# EAGLE design element-pro (EAGLE 9.1.1)
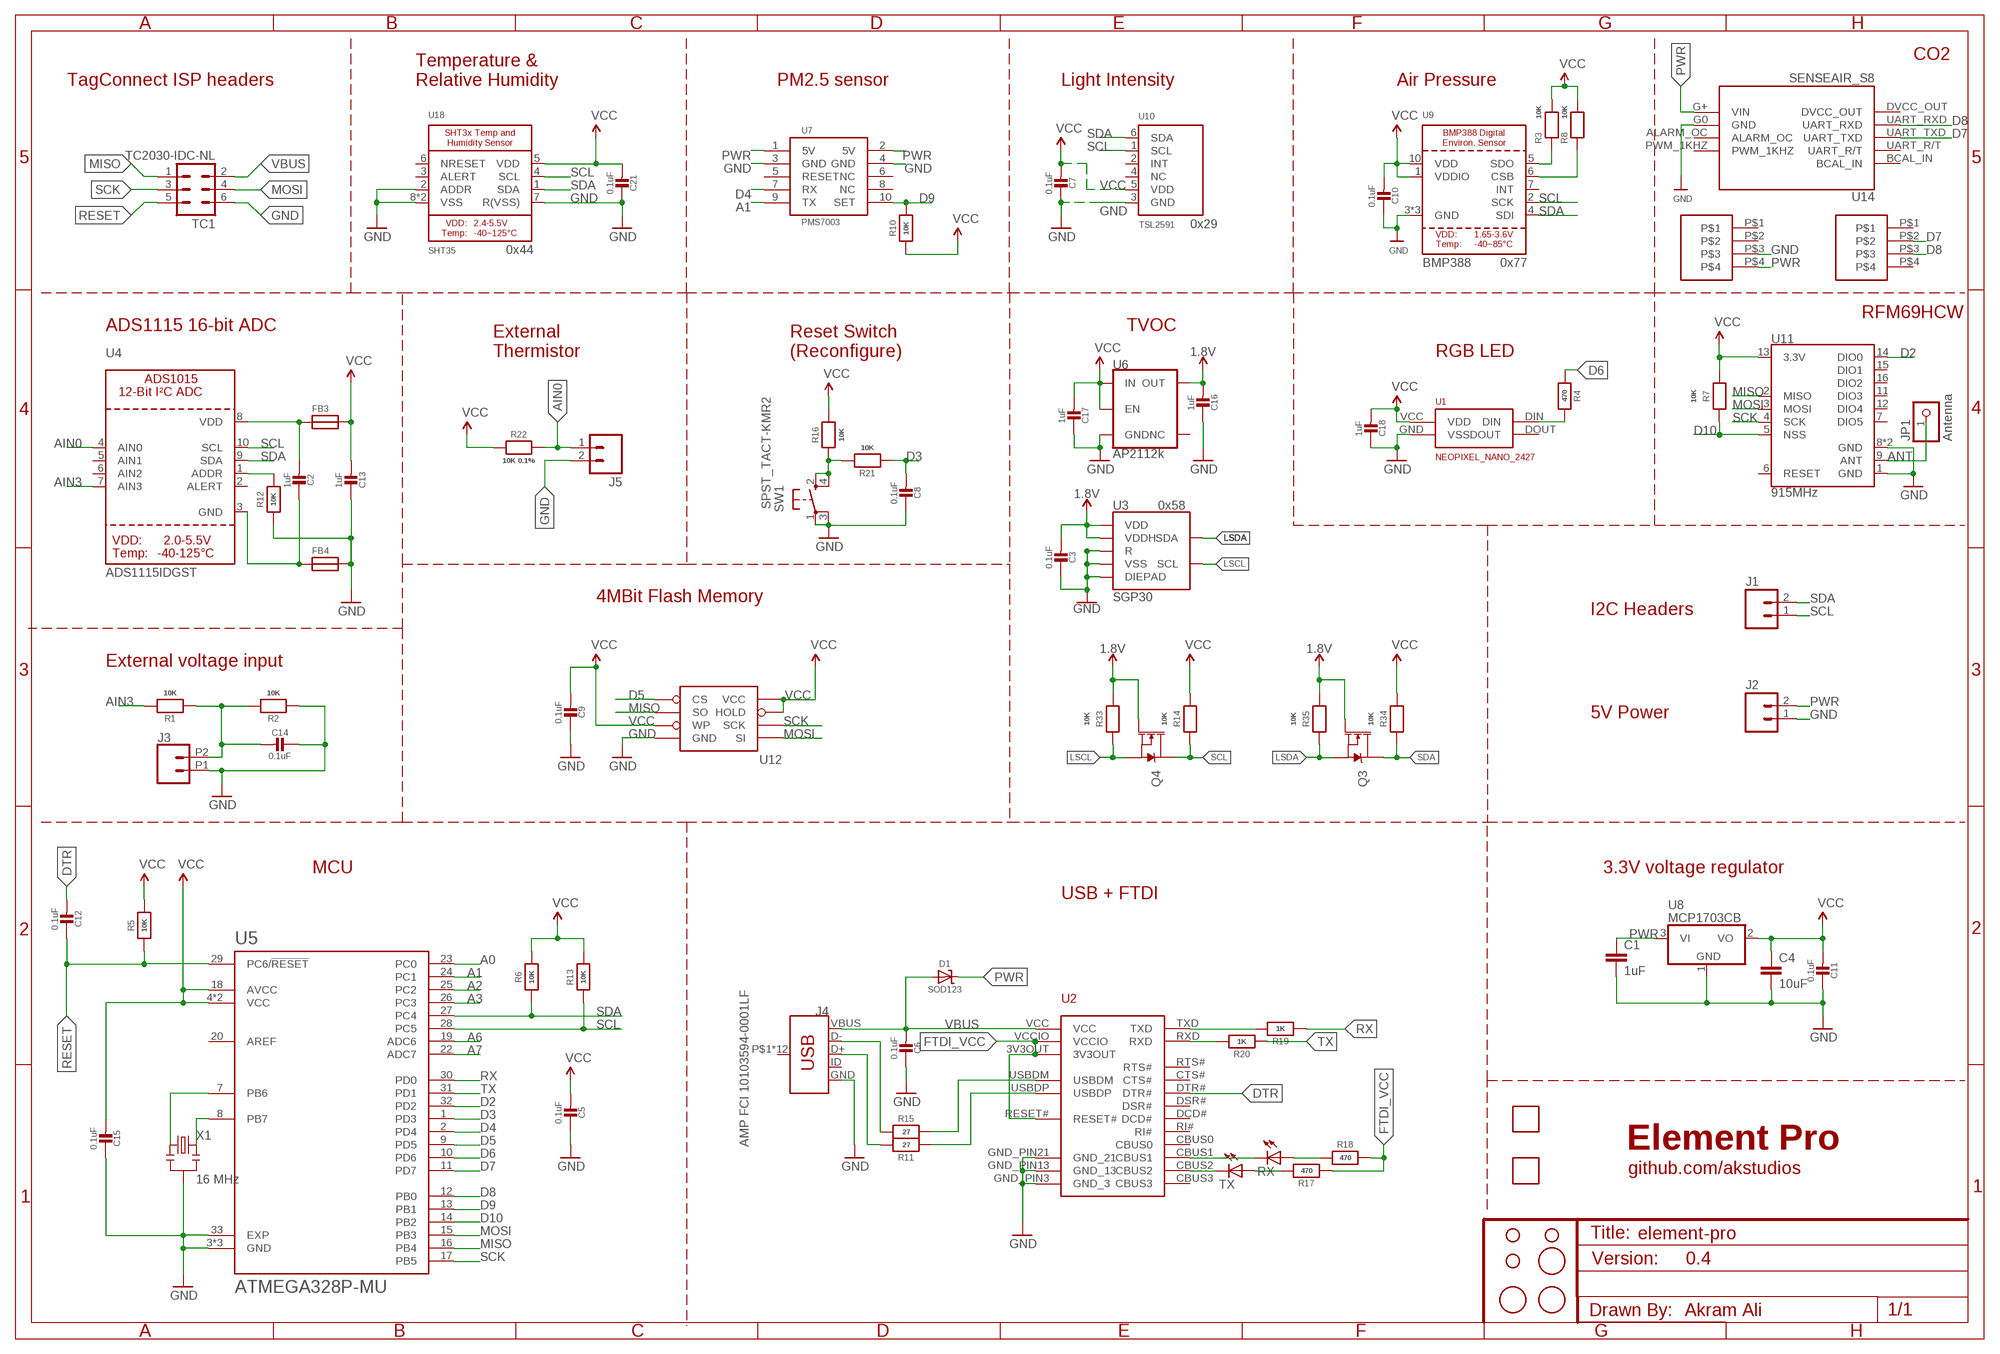
[diagram p0: schematic, sheet 1]

## Parts
C1  1uF  CAP0805  [0805@1]
C2  1uF  MICROBUILDER_CAP_CERAMIC_0402MP  [MICROBUILDER__0402MP]
C3  0.1uF  MICROBUILDER_CAP_CERAMIC_0402MP  [MICROBUILDER__0402MP]
C4  10uF  CAP0805  [0805@1]
C5  0.1uF  MICROBUILDER_CAP_CERAMIC_0402MP  [MICROBUILDER__0402MP]
C6  0.1uF  MICROBUILDER_CAP_CERAMIC_0402MP  [MICROBUILDER__0402MP]
C7  0.1uF  MICROBUILDER_CAP_CERAMIC_0402MP  [MICROBUILDER__0402MP]
C8  0.1uF  MICROBUILDER_CAP_CERAMIC_0402MP  [MICROBUILDER__0402MP]
C9  0.1uF  MICROBUILDER_CAP_CERAMIC_0402MP  [MICROBUILDER__0402MP]
C10  0.1uF  MICROBUILDER_CAP_CERAMIC_0402MP  [MICROBUILDER__0402MP]
C11  0.1uF  MICROBUILDER_CAP_CERAMIC_0402MP  [MICROBUILDER__0402MP]
C12  0.1uF  MICROBUILDER_CAP_CERAMIC_0402MP  [MICROBUILDER__0402MP]
C13  1uF  MICROBUILDER_CAP_CERAMIC_0402MP  [MICROBUILDER__0402MP]
C14  0.1uF  MICROBUILDER_CAP_CERAMIC_0402MP  [MICROBUILDER__0402MP]
C15  0.1uF  MICROBUILDER_CAP_CERAMIC_0402MP  [MICROBUILDER__0402MP]
C16  1uF  MICROBUILDER_CAP_CERAMIC_0402MP  [MICROBUILDER__0402MP]
C17  1uF  MICROBUILDER_CAP_CERAMIC_0402MP  [MICROBUILDER__0402MP]
C18  1uF  MICROBUILDER_CAP_CERAMIC_0402MP  [MICROBUILDER__0402MP]
C21  0.1uF  MICROBUILDER_CAP_CERAMIC_0402MP  [MICROBUILDER__0402MP]
D1  SOD123  MICROBUILDER_DIODE-SCHOTTKYSOD-123  [MICROBUILDER_SOD-123]
FB3  FERRITE0402  [0402]
FB4  FERRITE0402  [0402]
H1  STAND-OFF  [STAND-OFF]
H2  STAND-OFF  [STAND-OFF]
H3  STAND-OFF  [STAND-OFF]
J1  M02PTH  [1X02@1]
J2  M02PTH  [1X02@1]
J3  CONN_022.54MM_SCREWTERM  [1X02_2.54_SCREWTERM]
J4  AMP FCI 10103594-0001LF  USB_MICRO-B_HALF_PTH  [USB-MICROB-PTH]
J5  M02PTH  [1X02@1]
JP1  Antenna  PINHD-1X1CB  [1X01-CLEANBIG]
Q3  BSS138PW,115  MOSFET-NCH-BSS138PW,115  [SOT323]
Q4  BSS138PW,115  MOSFET-NCH-BSS138PW,115  [SOT323]
R1  10K  MICROBUILDER_RESISTOR_0402MP  [MICROBUILDER__0402MP]
R2  10K  MICROBUILDER_RESISTOR_0402MP  [MICROBUILDER__0402MP]
R3  10K  MICROBUILDER_RESISTOR_0402MP  [MICROBUILDER__0402MP]
R4  470  MICROBUILDER_RESISTOR_0402MP  [MICROBUILDER__0402MP]
R5  10K  MICROBUILDER_RESISTOR_0402MP  [MICROBUILDER__0402MP]
R6  10K  MICROBUILDER_RESISTOR_0402MP  [MICROBUILDER__0402MP]
R7  10K  MICROBUILDER_RESISTOR_0402MP  [MICROBUILDER__0402MP]
R8  10K  MICROBUILDER_RESISTOR_0402MP  [MICROBUILDER__0402MP]
R10  10K  MICROBUILDER_RESISTOR_0402MP  [MICROBUILDER__0402MP]
R11  27  MICROBUILDER_RESISTOR_0402MP  [MICROBUILDER__0402MP]
R12  10K  MICROBUILDER_RESISTOR_0402MP  [MICROBUILDER__0402MP]
R13  10K  MICROBUILDER_RESISTOR_0402MP  [MICROBUILDER__0402MP]
R14  10K  MICROBUILDER_RESISTOR_0402MP  [MICROBUILDER__0402MP]
R15  27  MICROBUILDER_RESISTOR_0402MP  [MICROBUILDER__0402MP]
R16  10K  MICROBUILDER_RESISTOR_0402MP  [MICROBUILDER__0402MP]
R17  470  MICROBUILDER_RESISTOR_0402MP  [MICROBUILDER__0402MP]
R18  470  MICROBUILDER_RESISTOR_0402MP  [MICROBUILDER__0402MP]
R19  1K  MICROBUILDER_RESISTOR_0402MP  [MICROBUILDER__0402MP]
R20  1K  MICROBUILDER_RESISTOR_0402MP  [MICROBUILDER__0402MP]
R21  10K  MICROBUILDER_RESISTOR_0402MP  [MICROBUILDER__0402MP]
R22  10K 0.1%  MICROBUILDER_RESISTOR_0402MP  [MICROBUILDER__0402MP]
R33  10K  MICROBUILDER_RESISTOR_0402MP  [MICROBUILDER__0402MP]
R34  10K  MICROBUILDER_RESISTOR_0402MP  [MICROBUILDER__0402MP]
R35  10K  MICROBUILDER_RESISTOR_0402MP  [MICROBUILDER__0402MP]
RX  LEDCHIPLED_0805  [CHIPLED_0805]
SW1  SPST_TACT-KMR2  [KMR2]
TC1  TC2030-IDC-NL  [TC2030-IDC-NL]
TX  LEDCHIPLED_0805  [CHIPLED_0805]
U1  NEOPIXEL_NANO_2427  [SK6805-2427]
U2  FT231XQ-R  [FTDI_FT231XQ-R_PACKAGE]
U3  SGP30  [SGP30]
U4  ADS1115IDGST  ADC_ADS1015  [MSOP10]
U5  ATMEGA328P-MU  [QFN50P500X500X100-33N]
U6  AP2112k  MIC5504  [SOT23-5]
U7  PMS7003  [PMS7003_RECEPTACLE_1.27MM_2X5]
U8  MCP1703CB  [SOT23]
U9  BMP388  [BMP388]
U10  TSL2591  LIGHT_TSL2591  [DFN6_TAOS]
U11  915MHz  RFM69HCW-915  [RFM69HCW-XXXS2]
U12  W25X40CLSNIG-ND-AT25F512BJEDEC_3.9MM  AT25F512BJEDEC_3.9MM  [SO08]
U14  SENSEAIR_S8  [SENSEAIR_S8]
U15  VLP-450-F  [VLP-450-F]
U16  VLP-450-F  [VLP-450-F]
U18  SHT35  SHT3X  [SHT3X]
U$1  FIDUCIAL  [FIDUCIAL_1MM]
U$2  FIDUCIAL  [FIDUCIAL_1MM]
U$3  FIDUCIAL  [FIDUCIAL_1MM]
U$4  0878980426  [CONN_4POS_VERT_2.54_SMD]
U$5  0878980426  [CONN_4POS_VERT_2.54_SMD]
X1  16 MHz  RESONATORSMD  [RESONATOR-SMD]

## Nets
1.8V: C3.2 C16.2 Q3.1(G) Q4.1(G) R33.2 R35.2 U3.1(VDD) U3.5(VDDH) U6.5(OUT)
A0: U5.23(PC0)
A1: U5.24(PC1) U7.9(TX)
A2: U5.25(PC2)
A3: U5.26(PC3)
A6: U5.19(ADC6)
A7: U5.22(ADC7)
ADDR: R12.2 U4.1(ADDR)
ADR: R3.1 U9.5(SDO)
AIN0: J5.1 R22.2 U4.4(AIN0)
AIN3: R1.2 U4.7(AIN3)
ANT: JP1.1 U11.9(ANT)
CS: R8.1 U9.6(CSB)
D2: U5.32(PD2) U11.14(DIO0)
D3: C8.2 R21.1 U5.1(PD3)
D4: U5.2(PD4) U7.7(RX)
D5: U5.9(PD5) U12.1_CS(CS)
D6: R4.1 U5.10(PD6)
D7: U5.11(PD7) U14.UART_TXD U$5.P$2
D8: U5.12(PB0) U14.UART_RXD U$5.P$3
D9: R10.2 U5.13(PB1) U7.10(SET)
D10: R7.1 U5.14(PB2) U11.5(NSS)
DTR: C12.2 U2.DTR#
FTDI_VCC: R17.1 R18.2 U2.3V3OUT U2.RESET# U2.VCCIO
GND: C1.2 C3.1 C4.2 C5.1 C6.1 C7.1 C8.1 C9.1 C10.1 C11.1 C13.1 C14.1 C15.1 C16.1 C17.1 C18.1 C21.1 FB4.2 J2.1 J3.P1 J4.GND J5.2 R2.1 R12.1 SW1.1(P) SW1.3(P1) TC1.6 U1.GND(VSS) U2.GND_PIN3(GND_3) U2.GND_PIN13(GND_13) U2.GND_PIN21(GND_21) U3.2(VSS) U3.4(R) U3.DIEPAD U5.3(GND) U5.5(GND) U5.21(GND) U5.33(EXP) U6.2(GND) U7.3(GND) U7.4(GND) U8.1(GND) U9.3(GND) U9.8(GND) U9.9(GND) U10.3(GND) U11.1(GND) U11.8(GND) U11.10(GND) U12.4_GND(GND) U14.G0(GND) U18.2(ADDR) U18.7(R(VSS)) U18.8(VSS) U18.THERMAL(VSS) U$4.P$3 X1.2
LSCL: Q4.2(S) R33.1 U3.6(SCL)
LSDA: Q3.2(S) R35.1 U3.3(SDA)
MISO: TC1.1 U5.16(PB4) U11.2(MISO) U12.2_SO(SO)
MOSI: TC1.4 U5.15(PB3) U11.3(MOSI) U12.5_SI(SI)
N$1: R4.2 U1.DIN
N$2: R20.2 U2.RXD
N$3: R19.2 U2.TXD
N$4: U5.8(PB7) X1.3
N$5: U5.7(PB6) X1.1
N$6: C14.2 J3.P2 R1.1 R2.2
N$12: C2.1 FB4.1 U4.3(GND)
N$15: C2.2 FB3.1 U4.8(VDD)
N$16: R16.1 R21.2 SW1.2(S) SW1.4(S1)
N$17: RX.C U2.CBUS1
N$18: TX.C U2.CBUS2
N$25: R15.2 U2.USBDM
N$26: R11.1 U2.USBDP
N$27: R18.1 RX.A
N$29: R17.2 TX.A
N$32: J4.D- R15.1
N$33: J4.D+ R11.2
PWR: C1.1 D1.C J2.2 U7.1(5V) U7.2(5V) U8.3(VI) U14.G+(VIN) U$4.P$4
RESET: C12.1 R5.1 TC1.5 U5.29(PC6/!RESET)
RX: R19.1 U5.30(PD0)
SCK: TC1.3 U5.17(PB5) U11.4(SCK) U12.6_SCK(SCK)
SCL: J1.1 Q4.3(D) R13.1 R14.1 U4.10(SCL) U5.28(PC5) U9.2(SCK) U10.1(SCL) U18.4(SCL)
SDA: J1.2 Q3.3(D) R6.1 R34.1 U4.9(SDA) U5.27(PC4) U9.4(SDI) U10.6(SDA) U18.1(SDA)
TX: R20.1 U5.31(PD1)
VBUS: C6.2 D1.A J4.VBUS TC1.2 U2.VCC
VCC: C4.1 C5.2 C7.2 C9.2 C10.2 C11.2 C13.2 C15.2 C17.2 C18.2 C21.2 FB3.2 R3.2 R5.2 R6.2 R7.2 R8.2 R10.1 R13.2 R14.2 R16.2 R22.1 R34.2 U1.VCC(VDD) U5.4(VCC) U5.6(VCC) U5.18(AVCC) U6.1(IN) U6.3(EN) U8.2(VO) U9.1(VDDIO) U9.10(VDD) U10.5(VDD) U11.13(3.3V) U12.3_WP(WP) U12.7_HOLD(HOLD) U12.8_VCC(VCC) U18.5(VDD)
Unconnected: J4.ID J4.P$1(SHIELD) J4.P$2(SHIELD) J4.P$3(SHIELD) J4.P$4(SHIELD) J4.P$6(SHIELD) J4.P$8(SHIELD) J4.P$10(SHIELD) J4.P$12(SHIELD) J4.SHEILD2(SHIELD) J4.SHIELD J4.SHIELD3(SHIELD) J4.SHIELD4(SHIELD) U1.DOUT U2.CBUS0 U2.CBUS3 U2.CTS# U2.DCD# U2.DSR# U2.RI# U2.RTS# U4.2(ALERT) U4.5(AIN1) U4.6(AIN2) U5.20(AREF) U6.4(NC) U7.5(RESET) U7.6(NC) U7.8(NC) U9.7(INT) U10.2(INT) U10.4(NC) U11.6(RESET) U11.7(DIO5) U11.11(DIO3) U11.12(DIO4) U11.15(DIO1) U11.16(DIO2) U14.ALARM_OC U14.BCAL_IN U14.DVCC_OUT U14.PWM_1KHZ U14.UART_R/T U18.3(ALERT) U18.6(NRESET) U$4.P$1 U$4.P$2 U$5.P$1 U$5.P$4

## Notes on the sheet
- CO2
- TagConnect ISP headers
- Temperature &
  Relative Humidity
- PM2.5 sensor | Light Intensity | Air Pressure
- 0x29
- 0x44
- 0x77
- RFM69HCW
- ADS1115 16-bit ADC | TVOC
- External
  Thermistor
- Reset Switch
  (Reconfigure)
- RGB LED
- 0x58
- 4MBit Flash Memory
- I2C Headers
- External voltage input
- 5V Power
- MCU | 3.3V voltage regulator
- USB + FTDI
- Element Pro
- github.com/akstudios
- 0.4
- Akram Ali

## Library data of the parts
C1 = SparkFun-Capacitors:CAP: Capacitor Standard 0603 ceramic capacitor, and 0.1" leaded capacitor.; MPN: CC0805ZRY5V8BB105
C2 C3 C5-C17 C21 = Adafruit Feather 32u4 Bluefruit LE:MICROBUILDER_CAP_CERAMIC: Ceramic Capacitors For new designs, use the packages preceded by an '_' character since they are more reliable: The following footprints should be used on most boards: _0402 - Standard footprint for regular board layouts _0603 - Standard footprint for regular board layouts _0805 - Standard footprint for regular board layouts _1206 - Standard footprint for regular board layouts For extremely tight-pitch boards where space is at a premium, the following 'micro-pitch' footprints can be used (smaller pads, no silkscreen outline, etc.): _0402MP - Micro-pitch footprint for very dense/compact boards _0603MP - Micro-pitch footprint for very dense/compact boards _0805MP - Micro-pitch footprint for very dense/compact boards _1206MP - Micro-pitch footprint for very dense/compact boards; MPN: GRM155R71C104KA88J
C4 = SparkFun-Capacitors:CAP: Capacitor Standard 0603 ceramic capacitor, and 0.1" leaded capacitor.; MPN: CC0805KKX5R6BB106
C18 = Adafruit Feather 32u4 Bluefruit LE:MICROBUILDER_CAP_CERAMIC: Ceramic Capacitors For new designs, use the packages preceded by an '_' character since they are more reliable: The following footprints should be used on most boards: _0402 - Standard footprint for regular board layouts _0603 - Standard footprint for regular board layouts _0805 - Standard footprint for regular board layouts _1206 - Standard footprint for regular board layouts For extremely tight-pitch boards where space is at a premium, the following 'micro-pitch' footprints can be used (smaller pads, no silkscreen outline, etc.): _0402MP - Micro-pitch footprint for very dense/compact boards _0603MP - Micro-pitch footprint for very dense/compact boards _0805MP - Micro-pitch footprint for very dense/compact boards _1206MP - Micro-pitch footprint for very dense/compact boards; MPN: CC0402KRX5R6BB105
D1 = Adafruit Feather 32u4 Bluefruit LE:MICROBUILDER_DIODE-SCHOTTKY; MPN: SD103AW-13-F
FB3 FB4 = ferrite:FERRITE: Ferrite Beads 0402 BLM15BX121SN1D - 120 Ohm, 600mA Ferrite Chip - Digikey: 490-11921-6-ND BKH1005LM152-T - 1.5K Ohm, 200mA Ferrite Chip - Digikey: 587-3216-1-ND 0603 MMZ1608B121C - 120 Ohm, 600mA Ferrite Chip - Digikey: 445-2164-1-ND BK1608HW121-T - 120 Ohm, 600mA Ferrite Chip - Digikey: 587-1876-2-ND 0805 HZ0805B272R-10 - 2.7K Ohm @ 100MHz, 200mA 0.8 Ohm DC Resistance - Digikey: 240-2504-1-ND (see also Murata BLM21BD272SN1L)
H1-H3 = SparkFun-Electromechanical:STAND-OFF: #4 Stand Off This is the mechanical footprint for a #4 phillips button head screw. Use the keepout ring to avoid running the screw head into surrounding components. SKU : PRT-00447
J1 J2 J5 = SparkFun-Connectors:M02: Standard 2-pin 0.1" header. Use with - straight break away headers ( PRT-00116) - right angle break away headers (PRT-00553) - swiss pins (PRT-00743) - machine pins (PRT-00117) - female headers (PRT-00115) Molex polarized connector foot print use with: PRT-08233 with associated crimp pins and housings. 2.54_SCREWTERM for use with PRT-10571. 3.5mm Screw Terminal footprints for PRT-08084 5mm Screw Terminal footprints for use with PRT-08432
J3 = SparkFun-Connectors:CONN_02: Multi connection point. Often used as Generic Header-pin footprint for 0.1 inch spaced/style header connections On any of the 0.1 inch spaced packages, you can populate with these: Break Away Headers - Straight <https://www.sparkfun.com/products/116> (PRT-00116) Break Away Male Headers - Right Angle <https://www.sparkfun.com/products/553> (PRT-00553) Female Headers <https://www.sparkfun.com/products/115> (PRT-00115) Break Away Headers - Machine Pin <https://www.sparkfun.com/products/117> (PRT-00117) Break Away Female Headers - Swiss Machine Pin <https://www.sparkfun.com/products/743> (PRT-00743) For SCREWTERMINALS and SPRING TERMINALS visit here: Screw Terimnals on SparkFun.com <https://www.sparkfun.com/search/results?term=Screw+Terminals> (5mm/3.5mm/2.54mm spacing) This device is also useful as a general connection point to wire up your design to another part of your project. Our various solder wires solder well into these plated through hole pads. Hook-Up Wire - Assortment (Stranded, 22 AWG) <https://www.sparkfun.com/products/11375> (PRT-11375) Hook-Up Wire - Assortment (Solid Core, 22 AWG) <https://www.sparkfun.com/products/11367> (PRT-11367) View the entire wire category on our website here <https://www.sparkfun.com/categories/141> Special notes: Molex polarized connector foot print use with: PRT-08233 with associated crimp pins and housings. 2.54_SCREWTERM for use with PRT-10571. 3.5mm Screw Terminal footprints for PRT-08084 5mm Screw Terminal footprints for use with PRT-08432
J4 = SparkFun-Connectors:USB_MICRO-B: USB Type Micro-B Connector Male/female and PTH/SMT variants SparkFun Products: SparkFun microB USB Breakout <https://www.sparkfun.com/products/12035> SparkFun USB microB Plug Breakout <https://www.sparkfun.com/products/10031> SparkFun ESP8266 Thing <https://www.sparkfun.com/products/13231>; PROD_ID: CONN-13711
JP1 = adafruit@1:PINHD-1X1: Pin header 1x1 for 0.1" spacing With round pins; MPN: Helical antenna
Q3 Q4 = MOSFETs:MOSFET-NCH: N-channel MOSFETs SOT23-3 and SOT323 (SC70) packages Designed by AKstudios
R1-R3 R5-R8 R10 R12-R14 R16 R21 R33-R35 = Adafruit Feather 32u4 Bluefruit LE:MICROBUILDER_RESISTOR: Resistors For new designs, use the packages preceded by an '_' character since they are more reliable: The following footprints should be used on most boards: _0402 - Standard footprint for regular board layouts _0603 - Standard footprint for regular board layouts _0805 - Standard footprint for regular board layouts _1206 - Standard footprint for regular board layouts For extremely tight-pitch boards where space is at a premium, the following 'micro-pitch' footprints can be used (smaller pads, no silkscreen outline, etc.): _0402MP - Micro-pitch footprint for very dense/compact boards _0603MP - Micro-pitch footprint for very dense/compact boards _0805MP - Micro-pitch footprint for very dense/compact boards _1206MP - Micro-pitch footprint for very dense/compact boards; MPN: RC0402JR-0710KL
R4 R17 R18 = Adafruit Feather 32u4 Bluefruit LE:MICROBUILDER_RESISTOR: Resistors For new designs, use the packages preceded by an '_' character since they are more reliable: The following footprints should be used on most boards: _0402 - Standard footprint for regular board layouts _0603 - Standard footprint for regular board layouts _0805 - Standard footprint for regular board layouts _1206 - Standard footprint for regular board layouts For extremely tight-pitch boards where space is at a premium, the following 'micro-pitch' footprints can be used (smaller pads, no silkscreen outline, etc.): _0402MP - Micro-pitch footprint for very dense/compact boards _0603MP - Micro-pitch footprint for very dense/compact boards _0805MP - Micro-pitch footprint for very dense/compact boards _1206MP - Micro-pitch footprint for very dense/compact boards; MPN: RC0402JR-07470RL
R11 R15 R22 = Adafruit Feather 32u4 Bluefruit LE:MICROBUILDER_RESISTOR: Resistors For new designs, use the packages preceded by an '_' character since they are more reliable: The following footprints should be used on most boards: _0402 - Standard footprint for regular board layouts _0603 - Standard footprint for regular board layouts _0805 - Standard footprint for regular board layouts _1206 - Standard footprint for regular board layouts For extremely tight-pitch boards where space is at a premium, the following 'micro-pitch' footprints can be used (smaller pads, no silkscreen outline, etc.): _0402MP - Micro-pitch footprint for very dense/compact boards _0603MP - Micro-pitch footprint for very dense/compact boards _0805MP - Micro-pitch footprint for very dense/compact boards _1206MP - Micro-pitch footprint for very dense/compact boards; MPN: RC0402JR-0727RL
R19 R20 = Adafruit Feather 32u4 Bluefruit LE:MICROBUILDER_RESISTOR: Resistors For new designs, use the packages preceded by an '_' character since they are more reliable: The following footprints should be used on most boards: _0402 - Standard footprint for regular board layouts _0603 - Standard footprint for regular board layouts _0805 - Standard footprint for regular board layouts _1206 - Standard footprint for regular board layouts For extremely tight-pitch boards where space is at a premium, the following 'micro-pitch' footprints can be used (smaller pads, no silkscreen outline, etc.): _0402MP - Micro-pitch footprint for very dense/compact boards _0603MP - Micro-pitch footprint for very dense/compact boards _0805MP - Micro-pitch footprint for very dense/compact boards _1206MP - Micro-pitch footprint for very dense/compact boards; MPN: RC0402JR-071KL
RX TX = adafruit:LED: LED OSRAM: - CHIPLED LG R971, LG N971, LY N971, LG Q971, LY Q971, LO R971, LY R971 LH N974, LH R974 LS Q976, LO Q976, LY Q976 LO Q996 - Hyper CHIPLED LW Q18S LB Q993, LB Q99A, LB R99A - SideLED LS A670, LO A670, LY A670, LG A670, LP A670 LB A673, LV A673, LT A673, LW A673 LH A674 LY A675 LS A676, LA A676, LO A676, LY A676, LW A676 LS A679, LY A679, LG A679 - Hyper Micro SIDELED® LS Y876, LA Y876, LO Y876, LY Y876 LT Y87S - SmartLED LW L88C, LW L88S LB L89C, LB L89S, LG L890 LS L89K, LO L89K, LY L89K LS L896, LA L896, LO L896, LY L896 - TOPLED LS T670, LO T670, LY T670, LG T670, LP T670 LSG T670, LSP T670, LSY T670, LOP T670, LYG T670 LG T671, LOG T671, LSG T671 LB T673, LV T673, LT T673, LW T673 LH T674 LS T676, LA T676, LO T676, LY T676, LB T676, LH T676, LSB T676, LW T676 LB T67C, LV T67C, LT T67C, LS T67K, LO T67K, LY T67K, LW E67C LS E67B, LA E67B, LO E67B, LY E67B, LB E67C, LV E67C, LT E67C LW T67C LS T679, LY T679, LG T679 LS T770, LO T770, LY T770, LG T770, LP T770 LB T773, LV T773, LT T773, LW T773 LH T774 LS E675, LA E675, LY E675, LS T675 LS T776, LA T776, LO T776, LY T776, LB T776 LHGB T686 LT T68C, LB T68C - Hyper Mini TOPLED® LB M676 - Mini TOPLED Santana® LG M470 LS M47K, LO M47K, LY M47K Source: http://www.osram.convergy.de/; MPN: LG R971-KN-1; OC_NEWARK: unknown
SW1 = adafruit:SPST_TACT: SMT 6mm switch, EVQQ2 series http://www.ladyada.net/library/eagle
TC1 = TagConnect:TC2030-IDC: Tag-Connect In Circuit Programming & Debug Cable 6 Pin http://www.tag-connect.com
U1 = NeoPixel Nano 2427:NEOPIXEL_NANO_2427; MPN: 3484
U2 = ftdi_ft231xq-r:FT231XQ-R: This is the 20-LD QFN package of the FTDI FT231XQ-R chip.; MPN: FT231XQ-R
U3 = SGP30:SGP30
U4 = microbuilder:ADC_ADS1015: ADS1015 - 12-bit 4-Channel I2C ADC with Internal PGA VDD: 2.0-5.5V Sampling Rate: 3.3ksps Gain Settings: 2/3, 1, 2, 4, 8, 16 I2C Address: ADDR low = 1001000x, ADDR high = 1001001x Internal Comparator The ADS1015 includes an internal comparator that can be set to output a high-level on ALERT when the conversion results exceeeds a pre-defined upper level, and will deassert itself when the level falls below a pre-defined lower threshold level. It can also be set to windowed mode where the ALERT pin will be asserted if the data exceeds the upper threshold or falls below the lower threshold.
U5 = ATMEGA328P-MU:ATMEGA328P-MU: ATmega Series 20 MHz 32 KB Flash 2 KB SRAM 8-Bit Microcontroller - QFN-32; AVAILABILITY: Good; DESCRIPTION: ATmega Series 20 MHz 32 KB Flash 2 KB SRAM 8-Bit Microcontroller - QFN-32; MF: Atmel; MP: ATMEGA328P-MU; MPN: ATMEGA328P-MU; PACKAGE: QFN-32 Atmel; PRICE: 2.55 USD
U6 = SGP30:MIC5504
U7 = Amphenol:PMS7003: 2x5 header 1.27mm pitch This is a library for Amphenol FCI 2x5 header with 1.27mm pitch used on Plant Tower's PMS7003 PM2.5 laser sensor. MPN: 20021311-00010T4LF Datasheet: http://www.mouser.com/ds/2/18/20021311-974469.pdf Designed by Akram Ali https://github.com/AKstudios; MPN: 20021311-00012T4LF
U8 = linear:MCP1703: 250 mA, 16V, Low Quiescent Current LDO Regulator Source: http://ww1.microchip.com/downloads/en/DeviceDoc/22049b.pdf; MPN: MCP1703T-3302E/CB; OC_NEWARK: 18T9177
U9 = microbuilder:BMP388
U10 = TSL2591:LIGHT_TSL2591: TSL2591 Light-To-Digital Sensor; MPN: TSL25911FN
U11 = SparkFun-RF:RFM69H: Hope RF RFM69H ISM Transceiver Module The RFM69H is a transceiver module capable of operation over a wide frequency range, including the 315,433,868 and 915MHz license-free ISM (Industry Scientific and Medical) frequency bands. All major RF communication parameters are programmable and most of them can be dynamically set. The RFM69H offers the unique advantage of programmable narrow-band and wide- band communication modes. The RFM69H is optimized for low power consumption while offering high RF output power and channelized operation.Compliance ETSI and FCC regulations. Datasheet <http://www.hoperf.cn/upload/docs/RF/SX/RFM69H_DataSheet_v1.3.pdf> SparkFun Products RFM69HCW Wireless Transceiver - 915MHz <https://www.sparkfun.com/products/13909> (COM-13909) RFM69HCW Wireless Transceiver - 434MHz <https://www.sparkfun.com/products/13910> (COM-13910) SparkFun RFM69 Breakout (915MHz) <https://www.sparkfun.com/products/12775> (WRL-12775) SparkFun RFM69 Breakout (434MHz) <https://www.sparkfun.com/products/12823> (WRL-12823); MPN: RFM69HCW; PROD_ID: IC-11997
U12 = LowPowerLab:AT25F512B: 4-Mbit SPI flash memory
U14 = SenseAir S8:SENSEAIR_S8: MH-z19 Footprint EAGLE footprint of MH-z19 CO2 sensor. Designed by AKstudios github.com/akstudios
U15 = VLP-450-F:VLP-450-F; MPN: VLP-650-F
U16 = VLP-450-F:VLP-450-F; MPN: VLP-550-F
U18 = Adafruit SHT31:SHT3X: SHT3x - Digital Temperature and Humidity Sensor Supply Voltage: 2.4-5.5V Humidity Accuracy: SHT30 = +/-3%RH, SHT31 = +/-2%RH Temperature Sensor: -40~125°C (+/-0.3°C from 10-55C); MPN: SHT35-DIS-B
U$1-U$3 = adafruit:FIDUCIAL: For use by pick and place machines to calibrate the vision/machine, 1mm By microbuilder.eu
U$4 U$5 = 0878980426:0878980426: CONN HEADER 4POS VERT 2.54MM SMD MPN: 0878980426 Designed by AKstudios github.com/AKstudios; MPN: 0878980426
X1 = SparkFun:RESONATOR: Resonator Small SMD resonator. This is the itty bitty 10/20MHz resonators with built in caps. CSTCE10M0G55 and CSTCE20M0V53. Footprint has been reviewed closely but hasn't been tested yet.; MPN: CSTCE16M0V53-R0

## Net classes
1 power: width 0.381 mm, clearance 0.254 mm

## Board
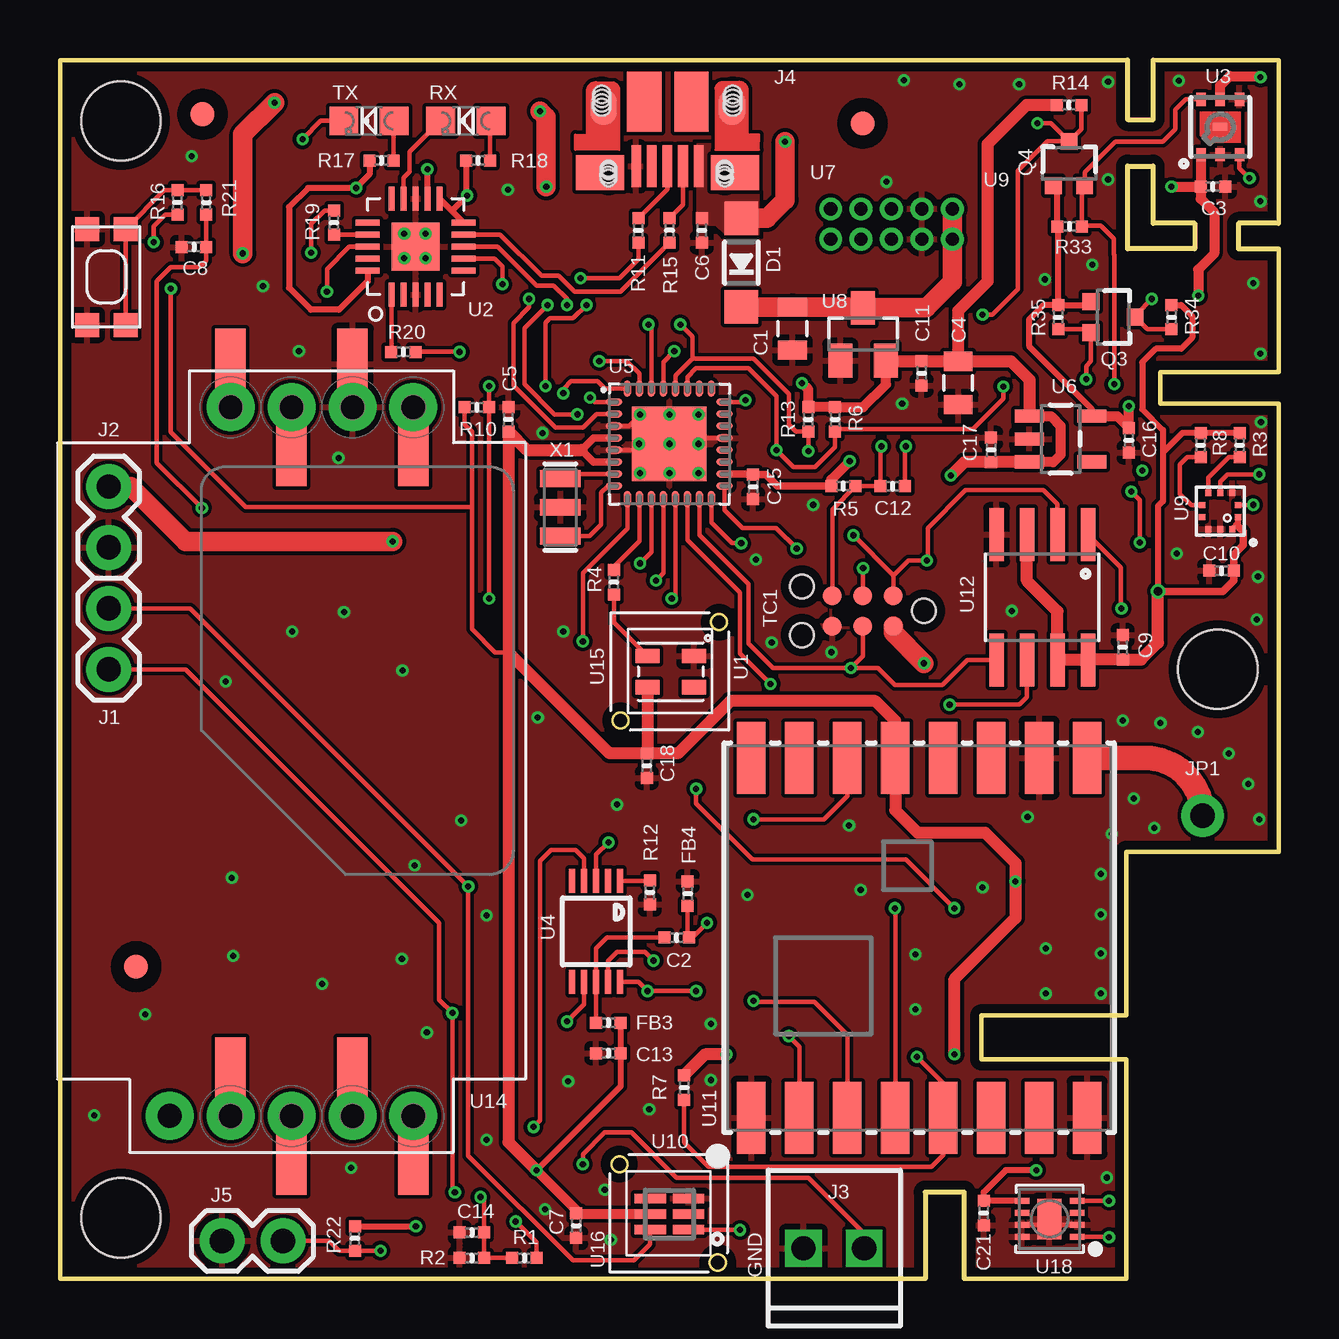
[diagram p1: board, top side]
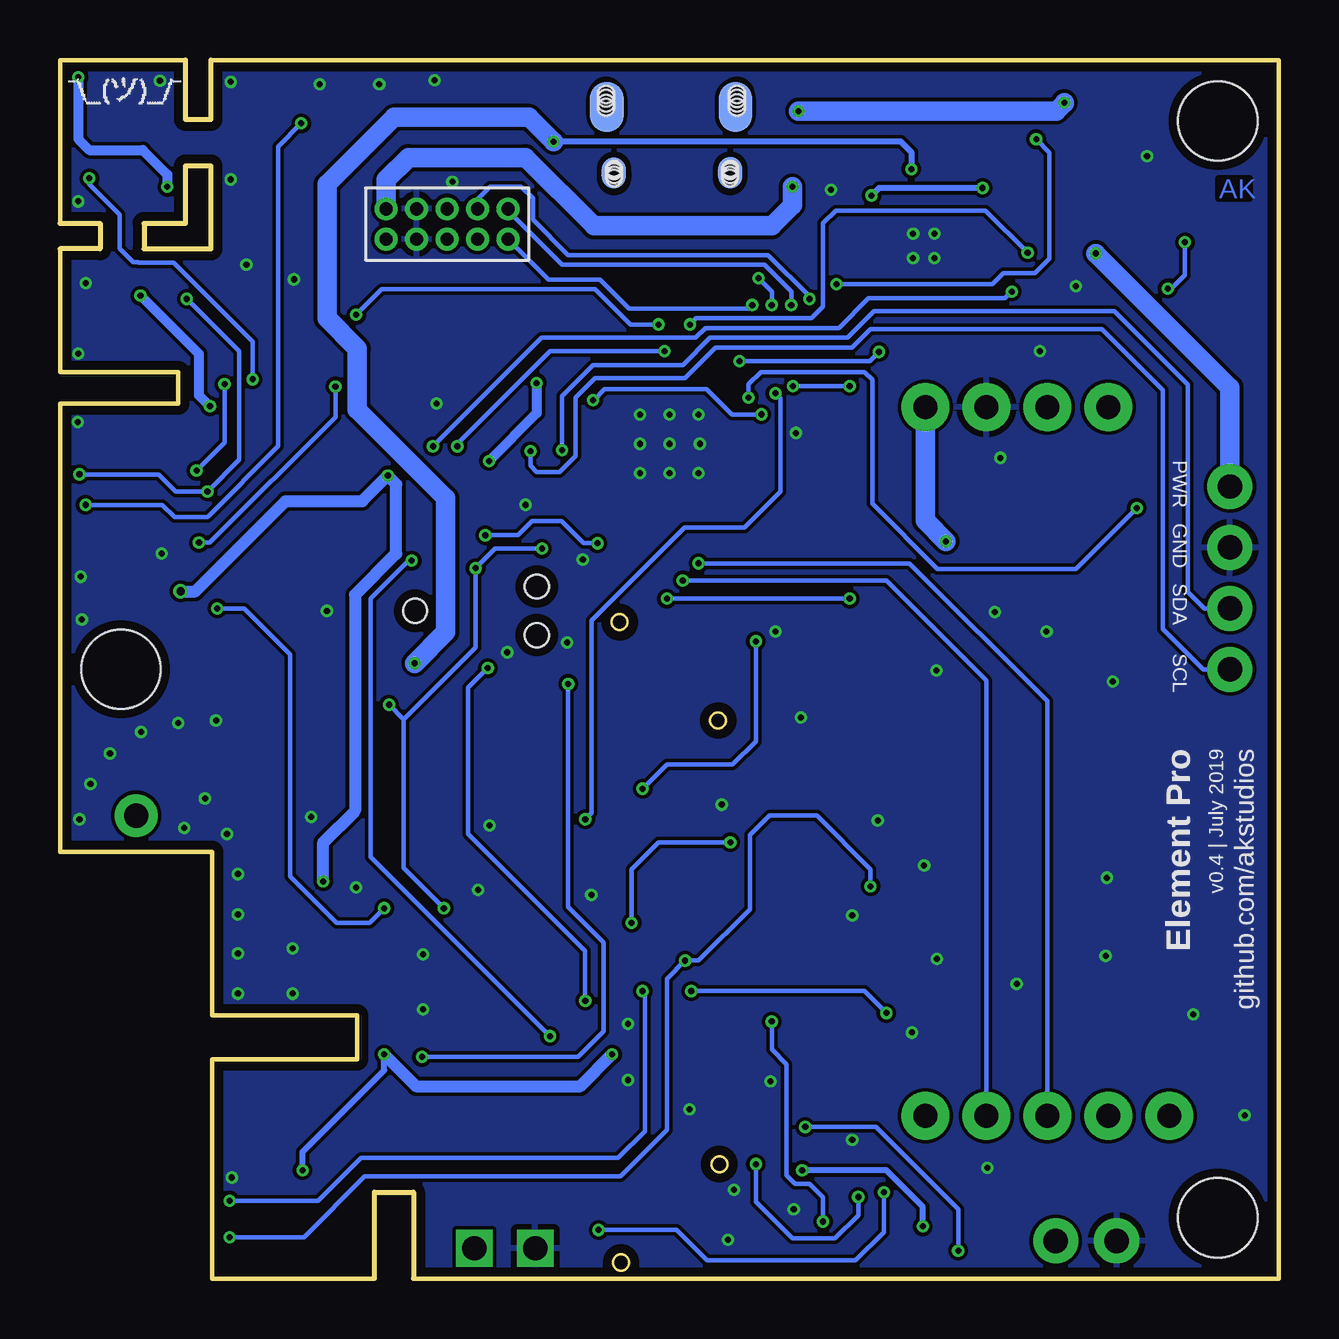
[diagram p2: board, bottom side, seen from below]

Size 50.8 x 50.8 mm. Coordinates in mm from the lower left corner, seen from the top.
Outline: 0,0 36.07,0 36.07,3.61 37.69,3.61 37.69,0 44.45,0 44.45,9.14 38.41,9.14 38.41,10.97 44.45,10.97 44.45,17.78 50.8,17.78 50.8,36.47 45.87,36.47 45.87,37.8 50.8,37.8 50.8,42.93 49.12,42.93 49.12,43.99 50.8,43.99 50.8,50.8 45.57,50.8 45.57,48.31 44.5,48.31 44.5,50.8 0,50.8 0,0
Outline: 47.3,43.99 45.57,43.99 45.57,46.38 44.5,46.38 44.5,42.93 47.3,42.93 47.3,43.99
Copper layers (1*16): Top 0.035559375mm / dielectric 1.6mm / Bottom 0.035559375mm
Design rules "oshpark-2layer *": minimum track width 6mil, minimum drill 10mil, track to track 6mil, track to pad 6mil, pad to pad 6mil, via to via 6mil, smd to smd 6mil, copper to edge 15mil, drill to drill 6mil, minimum pad ring 5mil, minimum via ring 5mil, stop-mask expansion 2.5mil, vias tented up to drill 14mil, thermal gap 10mil

### Footprints (pad centres in the part's own frame; a part is rotated, then mirrored left to right if it is on the bottom)
0805@1 = smd 0.8 x 1.2: 1 -0.9,0; 2 0.9,0
MICROBUILDER__0402MP = smd 0.5 x 0.5: 1 -0.508,0; 2 0.508,0
MICROBUILDER_SOD-123 = smd 1.4 x 1.4: A 1.85,0; C -1.85,0
0402 = smd 0.5 x 0.5: 1 -0.508,0; 2 0.508,0
STAND-OFF = hole 3.302: 0,0
1X02@1 = drill 1.016 pad 1.88: 1 0,0; 2 2.54,0
1X02_2.54_SCREWTERM = drill 1.016 square: P1 2.54,0; P2 0,0
USB-MICROB-PTH = smd 0.4 x 1.75: D+ 0.031,1.331; D- -0.619,1.331; GND 1.331,1.331; ID 0.681,1.331; VBUS -1.269,1.331 | smd 1.4 x 2.1 bottom: P$1 2.701,-1.142; P$3 -2.659,-1.144 | smd 1 x 1.3: P$2 2.487,1.594; P$6 -2.368,1.604 | smd 1 x 1.3 bottom: P$4 -2.368,1.604; P$10 2.481,1.598 | smd 1.1 x 1.5: P$8 2.701,-1.142; P$12 -2.659,-1.144 | smd 2 x 1.46: SHEILD2 2.831,1.606; SHIELD -2.794,1.606 | smd 1.425 x 2.5: SHIELD3 -0.979,-1.349; SHIELD4 0.996,-1.352 | hole 0.7: -2.693,-1.134; -2.693,-1.3; -2.694,-1.499; -2.694,-1.664; 2.768,-1.134; 2.767,-1.303; 2.766,-1.496; 2.766,-1.664 | hole 0.66: -2.359,1.821; -2.349,1.691; -2.359,1.541; -2.354,1.432; 2.481,1.821; 2.491,1.691; 2.481,1.541; 2.486,1.432
1X01-CLEANBIG = drill 1.016 pad 1.778: 1 0,0
SOT323 = smd 0.7 x 0.7: 1 -0.65,-0.925; 2 0.65,-0.925; 3 0,0.925
CHIPLED_0805 = smd 1.2 x 1.2: A 0,-1.05; C 0,1.05
KMR2 = smd 1 x 1: 1 2,0.8; 2 2,-0.8; 3 -2,0.8; 4 -2,-0.8
TC2030-IDC-NL = smd 0.787 x 0.787: 1 -1.27,-0.635; 2 -1.27,0.635; 3 0,-0.635; 4 0,0.635; 5 1.27,-0.635; 6 1.27,0.635 | hole 0.991: -2.54,0; 2.54,1.016; 2.54,-1.016
SK6805-2427 = smd 1 x 0.6: DIN 0.375,1.85; DOUT 2.325,0.55; GND 2.325,1.85; VCC 0.375,0.55
FTDI_FT231XQ-R_PACKAGE = smd 0.25 x 1: 3V3OUT 0.968,-2.032; CBUS2 -0.532,-2.032; CBUS3 0.968,1.968; CTS# -1.032,-2.032; DTR# -0.032,1.968; RTS# -0.532,1.968; TXD 0.468,1.968; USBDM 0.468,-2.032; USBDP -0.032,-2.032; VCCIO -1.032,1.968 | smd 1 x 0.25: CBUS0 1.968,0.968; CBUS1 1.968,0.468; DCD# -2.032,-1.032; DSR# -2.032,-0.532; GND_PIN3 -2.032,-0.032; GND_PIN13 1.968,-0.032; RESET# 1.968,-1.032; RI# -2.032,0.468; RXD -2.032,0.968; VCC 1.968,-0.532 | smd 2 x 2: GND_PIN21 -0.032,-0.032
SGP30 = smd 0.55 x 0.4: 1 -1.15,0.8; 2 -1.15,0; 3 -1.15,-0.8; 4 1.15,-0.8; 5 1.15,0; 6 1.15,0.8 | smd 0.305 x 0.61: DIEPAD 0,0
MSOP10 = smd 0.25 x 1: 1 -1,-2.113; 2 -0.5,-2.113; 3 0,-2.113; 4 0.5,-2.113; 5 1,-2.113; 6 1,2.113; 7 0.5,2.113; 8 0,2.113; 9 -0.5,2.113; 10 -1,2.113
QFN50P500X500X100-33N = smd 0.7 x 0.3: 1 -2.3,1.75; 2 -2.3,1.25; 3 -2.3,0.75; 4 -2.3,0.25; 5 -2.3,-0.25; 6 -2.3,-0.75; 7 -2.3,-1.25; 8 -2.3,-1.75; 17 2.3,-1.75; 18 2.3,-1.25; 19 2.3,-0.75; 20 2.3,-0.25; 21 2.3,0.25; 22 2.3,0.75; 23 2.3,1.25; 24 2.3,1.75 | smd 0.3 x 0.7: 9 -1.75,-2.3; 10 -1.25,-2.3; 11 -0.75,-2.3; 12 -0.25,-2.3; 13 0.25,-2.3; 14 0.75,-2.3; 15 1.25,-2.3; 16 1.75,-2.3; 25 1.75,2.3; 26 1.25,2.3; 27 0.75,2.3; 28 0.25,2.3; 29 -0.25,2.3; 30 -0.75,2.3; 31 -1.25,2.3; 32 -1.75,2.3 | smd 3.1 x 3.1: 33 0,0
SOT23-5 = smd 0.55 x 1.2: 1 -0.95,-1.3; 2 0,-1.3; 3 0.95,-1.3; 4 0.95,1.3; 5 -0.95,1.3
PMS7003_RECEPTACLE_1.27MM_2X5 = drill 0.55 pad 0.95: 1 4.865,4.865; 2 6.135,4.865; 3 4.865,6.135; 4 6.135,6.135; 5 4.865,7.405; 6 6.135,7.405; 7 4.865,8.675; 8 6.135,8.675; 9 4.865,9.945; 10 6.135,9.945
SOT23 = smd 1 x 1.4: 1 -0.95,-1.1; 2 0.95,-1.1; 3 0,1.1
BMP388 = smd 0.25 x 0.275: 1 0.25,0.75; 2 -0.25,0.75; 6 -0.25,-0.75; 7 0.25,-0.75 | smd 0.275 x 0.25: 3 -0.762,0.5; 4 -0.762,0; 5 -0.762,-0.5; 8 0.762,-0.5; 9 0.762,0; 10 0.762,0.5
DFN6_TAOS = smd 1.3 x 0.4: 1 -0.8,0.65; 2 -0.8,0; 3 -0.8,-0.65; 4 0.8,-0.65; 5 0.8,0; 6 0.8,0.65
RFM69HCW-XXXS2 = smd 3 x 1.2: 1 -7.5,7; 2 -7.5,5; 3 -7.5,3; 4 -7.5,1; 5 -7.5,-1; 6 -7.5,-3; 7 -7.5,-5; 8 -7.5,-7; 9 7.5,-7; 10 7.5,-5; 11 7.5,-3; 12 7.5,-1; 13 7.5,1; 14 7.5,3; 15 7.5,5; 16 7.5,7
SO08 = smd 0.61 x 2.21: 1_CS -1.905,-2.616; 2_SO -0.635,-2.616; 3_WP 0.635,-2.616; 4_GND 1.905,-2.616; 5_SI 1.905,2.616; 6_SCK 0.635,2.616; 7_HOLD -0.635,2.616; 8_VCC -1.905,2.616
SENSEAIR_S8 = drill 1 pad 2: ALARM_OC 1.515,9.75; BCAL_IN 31.055,4.67; DVCC_OUT 31.055,14.83; G0 1.515,12.29; G+ 1.515,14.83; PWM_1KHZ 1.515,7.21; UART_R/T 31.055,7.21; UART_RXD 31.055,12.29; UART_TXD 31.055,9.75
SHT3X = smd 0.6 x 0.25: 1 -1.15,0.75; 2 -1.15,0.25; 3 -1.15,-0.25; 4 -1.15,-0.75; 5 1.15,-0.75; 6 1.15,-0.25; 7 1.15,0.25; 8 1.15,0.75 | smd 1 x 1.7: THERMAL 0,0
FIDUCIAL_1MM = smd 1 x 1: 1 0,0
CONN_4POS_VERT_2.54_SMD = smd 1.27 x 2.96: P$1 0.635,1.8; P$2 3.175,-1.8; P$3 5.715,1.8; P$4 8.255,-1.8
RESONATOR-SMD = smd 0.7 x 1.7: 1 -1.2,0; 2 0,0; 3 1.2,0

### Placement (x,y rotation side)
C1  30.53,39.6 270 top
C2  25.7,14.22 180 top
C3  48.06,45.52 180 top
C4  37.44,37.34 270 top
C5  18.69,35.81 270 top
C6  26.76,43.7 90 top
C7  21.52,2.21 90 top
C8  5.59,43 0 top
C9  44.3,26.31 270 top
C10  48.41,29.51 0 top
C11  35.92,37.74 90 top
C12  34.71,33.03 0 top
C13  22.86,9.4 0 top
C14  17.17,1.93 0 top
C15  28.89,33.01 90 top
C16  44.55,34.95 90 top
C17  38.81,34.54 270 top
C18  24.46,21.39 90 top
C21  38.51,2.74 90 top
D1  28.4,42.35 90 top
FB3  22.86,10.67 0 top
FB4  26.16,16.05 90 top
H1  2.54,48.26 0 top
H2  2.54,2.54 0 top
H3  48.26,25.4 0 top
J1  2.03,25.4 90 top
J2  2.03,30.48 90 top
J3  33.53,1.27 180 top
J4  25.35,47.7 180 top
J5  9.3,1.57 180 top
JP1  47.62,19.3 0 top
Q3  43.89,40.08 270 top
Q4  42.06,46.48 0 top
R1  19.35,0.86 0 top
R2  17.17,0.86 0 top
R3  49.17,34.75 90 top
R4  23.09,29.03 270 top
R5  32.66,33.04 180 top
R6  32.31,35.81 90 top
R7  26.01,7.97 90 top
R8  47.55,34.75 90 top
R10  17.37,36.32 0 top
R11  24.11,43.7 90 top
R12  24.59,16.1 90 top
R13  31.19,35.81 90 top
R14  42.06,48.92 180 top
R15  25.41,43.7 270 top
R16  4.9,44.86 270 top
R17  13.4,46.61 0 top
R18  17.43,46.61 180 top
R19  11.42,44.02 270 top
R20  14.32,38.63 180 top
R21  6.1,44.86 90 top
R22  12.29,1.68 270 top
R33  42.09,43.86 180 top
R34  46.33,40.08 90 top
R35  41.61,40.08 90 top
RX  16.91,48.26 90 top
SW1  1.93,41.76 90 top
TC1  33.46,27.84 180 top
TX  12.88,48.26 90 top
U1  24.1,24.1 0 top
U2  14.79,43.05 90 top
U3  48.36,48.01 90 top
U4  22.35,14.48 180 top
U5  25.4,34.8 0 top
U6  41.71,35 270 top
U7  42.07,49.46 270 bottom
U8  33.48,39.37 0 top
U9  48.36,32 270 top
U10  25.4,2.69 180 top
U11  35.81,14.21 90 top
U12  40.94,28.4 180 top
U14  -0.1,37.85 270 top
U15  23.37,23.27 0 top
U16  23.32,4.78 270 top
U18  41.25,2.49 180 top
U$1  5.94,48.54 0 top
U$2  3.17,13 0 top
U$3  33.45,48.16 0 top
U$4  6.48,36.32 0 top
U$5  6.48,6.78 0 top
X1  20.86,32.16 270 top

### Tracks (layer width: path | path; a pad name or v marks a point on that pad's centre or on a via)
1.8V  (via drill 0.25)
  Top 0.254: Q4.1 41.58,45.39 R33.2 41.6,43.83 R35.2 | R35.2 42.82,40.59 Q3.1 | R35.2 41,40.59 40.39,39.98 40.39,38.88 43.01,36.26 U6.5
  Top 0.406: U6.5 44.07,35.95 44.55,35.47 C16.2 v44.55,36.37 | C3.2 47.55,45.01 48.11,44.45 48.11,42.73 47.45,42.07 v47.45,40.98 | U3.1 47.56,45.53 C3.2 | U3.5 48.36,49.73 48.76,50.13 49.99,50.13 v50.04,50.08 | v46.33,45.52 C3.2
  Bottom 0.406: v44.55,36.37 45.01,36.83 45.01,38.56 47.43,40.98 v47.45,40.98 | v50.04,50.08 50.04,47.5 49.58,47.04 47.35,47.04 46.33,46.02 v46.33,45.52
A1  (via drill 0.25)
  Top 0.178: U5.24 28.5,36.55 v28.57,36.63 | v20.32,40.59 19.36,39.62 19.36,37.29 20.61,36.03 v21.57,36.03
  Bottom 0.178: v20.32,40.59 20.32,41.15 21.44,42.27 29.87,42.27 32.12,44.52 U7.9 | v21.57,36.03 22.79,36.03 23.85,37.08 28.09,37.08 28.55,36.63 v28.57,36.63
ADDR
  Top 0.178: R12.2 24.57,16.59 U4.1
ADR
  Top 0.178: U9.5 47.86,33.38 48.72,34.24 R3.1
AIN0  (via drill 0.25)
  Top 0.178: J5.1 11.23,1.57 11.63,1.17 R22.2 v13.36,1.17 | U4.4 21.85,17.52 21.49,17.88 20.47,17.88 20.02,17.42 20.02,6.6 v19.74,6.33
  Bottom 0.178: v13.36,1.17 13.36,2.9 16.79,6.33 v19.74,6.33
AIN3  (via drill 0.25)
  Top 0.178: v21.13,10.72 21.85,11.44 U4.7 | v19,2.38 19.86,1.52 R1.2
  Bottom 0.178: v21.13,10.72 21.13,9.55 20.52,8.94 20.52,4.32 20.17,3.96 19.56,3.96 19,3.4 v19,2.38
ANT
  Top 1.016: JP1.1 arc90 45.22,21.71 U11.9
CS
  Top 0.178: U9.6 47.15,32.25 46.69,32.72 46.69,33.93 46.99,34.24 R8.1
D2  (via drill 0.25)
  Top 0.178: U5.32 22.72,37.1 22.4,37.41 21.31,37.41 20.98,37.08 v20.98,36.91 | v28.91,19.15 31.85,19.15 32.81,20.11 U11.14
  Bottom 0.178: v20.98,36.91 20.78,36.7 20.78,32.82 22.28,31.32 24.77,31.32 28.65,27.43 28.65,19.41 v28.91,19.15
D3  (via drill 0.25)
  Top 0.178: U5.1 22.28,36.55 v22.1,36.73 | R21.1 C8.2 6.1,42.44 5.82,42.16 4.62,42.16 4.04,41.58 4.04,34.01 v5.92,32.13
  Bottom 0.178: v5.92,32.13 8.45,29.59 14.22,29.59 16.95,32.31 16.95,37.47 17.27,37.8 21.59,37.8 22.1,37.29 v22.1,36.73
D4  (via drill 0.25)
  Top 0.178: v19.56,40.84 19.56,40.49 18.9,39.83 18.9,37.24 20.65,35.48 21.79,35.48 22.36,36.05 U5.2
  Bottom 0.178: v19.56,40.84 19.56,40.95 21.28,42.67 29.62,42.67 31.09,44.15 31.09,45.03 31.57,45.52 32.87,45.52 33.39,44.99 U7.7
D5  (via drill 0.25)
  Top 0.178: U5.9 23.65,31.27 21.79,29.41 v21.79,26.57 | v44.25,27.94 44.22,27.96 44.22,29.64 U12.1_CS | v37.29,15.44 35.26,17.48 28.85,17.48 26.52,19.81 v26.52,20.42
  Bottom 0.178: v37.29,15.44 37.9,14.83 39.27,14.83 41.2,16.76 41.2,26.01 43.13,27.94 v44.25,27.94 | v26.52,20.42 25.5,21.44 22.76,21.44 21.79,22.4 v21.79,26.57
D6
  Top 0.178: U5.10 24.15,30.75 23.09,29.69 R4.1
D7  (via drill 0.25)
  Top 0.178: U5.11 24.65,30.29 v24.18,29.82 | U$5.P$2 U14.UART_TXD
  Bottom 0.178: v24.18,29.82 15.39,29.82 9.65,24.08 U14.UART_TXD
D8  (via drill 0.25)
  Top 0.178: U5.12 25.15,29.42 v24.84,29.11 | U$5.P$3 U14.UART_RXD
  Bottom 0.178: v24.84,29.11 16.36,29.11 12.19,24.94 U14.UART_RXD
D9  (via drill 0.25)
  Top 0.178: U5.13 25.65,28.5 v25.5,28.35 | v17.88,28.35 R10.2 v17.88,37.21 | v21.95,40.59 21.39,40.03 20.42,40.03 20.24,39.85 v20.24,37.21
  Bottom 0.178: v25.5,28.35 v17.88,28.35 | U7.10 30.45,41.65 28.29,41.65 27.08,40.44 22.1,40.44 v21.95,40.59 | v17.88,37.21 v20.24,37.21
D10  (via drill 0.25)
  Top 0.178: v29.62,24.79 28.35,26.06 28.35,28.6 26.15,30.8 U5.14 | v35.71,9.25 36.81,8.14 U11.5 36.81,5.17 36.32,4.67 27.03,4.67 26.01,5.68 R7.1
  Bottom 0.178: v35.71,9.25 29.21,9.25 28.14,10.31 28.14,14.02 29.62,15.49 v29.62,24.79
DTR  (via drill 0.25)
  Top 0.178: C12.2 35.21,34.66 v35.26,34.7 | U2.DTR# 12.06,43.02 11.12,42.09 v11.12,41.15
  Bottom 0.178: v35.26,34.7 30.73,39.22 24.31,39.22 23.9,39.62 18.34,39.62 17.09,40.87 11.4,40.87 v11.12,41.15
FTDI_VCC  (via drill 0.25)
  Top 0.254: U2.VCCIO 12.82,41.58 11.63,40.39 10.46,40.39 9.55,41.3 9.55,44.68 10.34,45.47 v12.33,45.47 | v12.33,45.47 v12.34,45.47 | R17.1 12.9,46.03 v12.33,45.47 | U2.RESET# 16.32,44.52 | 16.32,44.52 U2.3V3OUT | 16.32,44.52 16.34,44.52 v16.97,45.15 16.92,45.2 R18.2
  Bottom 0.254: v12.34,45.47 16.66,45.47 v16.97,45.15
GND  (via drill 0.25)
  Top 0.178: U5.5 23.88,34.55 v24.13,34.8 | U5.21 26.87,35.05 v26.62,34.8 | U2.GND_PIN21 v14.35,42.55 | U5.3 23.71,35.55 v24.18,36.02 | U18.7 41,2.24 U18.THERMAL 41.5,2.24 U18.2
  other vias: 29.01,29.97 22.71,3.71 20.22,2.9 8.46,41.38 49.99,19.15 45.62,18.8 43.38,16.87 43.38,13.56 41.1,13.77 23.22,19.76 9.68,26.97 33.38,16.21 35.66,13.51 43.84,18.54 43.38,15.19 43.38,11.89 22.96,1.63 17.78,5.79 40.34,19.25 38.46,16.31 41.05,41.66 31.39,32.26 47.42,22.78 39.98,49.78 32.89,18.9 19.91,23.39 24.56,7.06 14.25,13.34 16.71,19.1 14.78,17.22 6.91,24.89 3.56,11.02 5.49,46.79 18.67,45.39 9.96,38.66 11.84,27.79 1.42,6.81 15.29,10.26 28.65,16 20.98,26.97 34.44,45.72 11.61,34.21 14.27,25.35 24.18,33.58 26.62,33.58 25.4,33.58 25.4,36.02 26.62,36.02 14.35,43.56 15.24,43.56 15.24,42.55 25.4,34.8 43.64,4.22 7.21,13.46 41.1,11.89 35.66,11.23 27.13,8.28 17.78,15.14 27.13,10.62 21.18,8.23 12.14,4.62 10.92,12.29 7.16,16.71 49.53,20.62 20.12,35.26 48.72,21.89 45.87,23.16 44.3,23.27 49.73,41.5 49.89,27.48 39.67,27.84 35.1,36.47 50.04,38.56 29.67,26.52 32.16,26.11 44.75,20.02 35.18,49.96 46.56,30.23 43.69,49.89 43.03,42.27 37.49,49.78 50.04,44.91 46.63,49.94 43.69,45.82 50.06,35.71 49.94,29.26
  pour Top (rank 6): -0.25,51.05 51.05,51.05 51.05,-0.25 -0.25,-0.25
  pour Bottom: -0.51,51.31 51.31,51.31 51.31,-0.51 -0.51,-0.51
LSCL  (via drill 0.25)
  Top 0.178: R33.1 42.6,43.94 | 42.6,43.94 42.6,45.44 Q4.2 42.71,46.12 43.99,47.4 45.97,47.4 46.48,47.9 46.48,48.72 46.92,49.16 U3.6 | v43.94,37.29 43.94,42.68 43.93,42.69 43.93,43.34 43.38,43.89 42.65,43.89 42.6,43.94
  Bottom 0.178: v45.11,33.68 43.94,34.85 v43.94,37.29
LSDA  (via drill 0.25)
  Top 0.178: R35.1 42.82,39.57 Q3.2 42.97,38.24 42.77,38.05 v42.77,37.49 | U3.3 49.16,46.29 v49.58,45.87
  Bottom 0.178: v49.58,45.87 49.58,45.62 48.31,44.35 48.31,42.93 47.75,42.37 47.54,42.37 47.53,42.36 46.06,42.36 42.77,39.06 v42.77,37.49
MISO  (via drill 0.25)
  Top 0.178: TC1.1 34.73,29.31 34.74,29.32 | 34.74,29.32 v33.07,30.99 | U5.16 27.15,31.52 28.02,30.66 v28.4,30.66 | U11.2 30.81,9.67 v30.38,10.11 | 34.74,29.32 35.36,29.93 v36.14,29.93 36.17,29.96 36.17,31.29 37.74,32.87 41,32.87 41.58,32.28 U12.2_SO
  Bottom 0.178: v30.38,10.11 37.85,17.58 37.85,28.35 36.26,29.93 v36.14,29.93 | v33.07,30.99 31.7,30.99 31.11,31.57 29.9,31.57 28.98,30.66 v28.4,30.66
MOSI  (via drill 0.25)
  Top 0.178: TC1.4 33.46,25.95 v32.97,25.45 | v32.97,25.45 29.72,25.45 28.7,26.47 28.7,28.96 26.65,31.01 U5.15 | v28.91,11.58 28.96,11.53 31.45,11.53 32.81,10.16 U11.3 | U12.5_SI 37.82,25.78 36.78,24.74 34.8,24.74 34.09,25.45 v32.97,25.45
  Bottom 0.178: v28.91,11.58 28.91,13.66 33.78,18.54 33.78,24.64 v32.97,25.45
N$1
  Top 0.178: R4.2 23.09,27.35 U1.DIN
N$2
  Top 0.178: R20.2 13.82,38.64 U2.RXD
N$3
  Top 0.178: U2.TXD 11.43,43.52 R19.2
N$4
  Top 0.178: X1.3 22.07,30.96 22.55,31.45 22.55,32.77 22.84,33.05 U5.8
N$5
  Top 0.178: U5.7 21.25,33.55 X1.1
N$6  (via drill 0.25)
  Top 0.178: R1.1 R2.2 C14.2 17.68,3.25 v17.53,3.4 | J3.P2 33.53,1.88 31.19,4.22 25.7,4.22 23.82,6.1 22.71,6.1 21.79,5.18 v21.79,4.78
  Bottom 0.178: v21.79,4.78 21.79,3.2 20.27,1.68 18.49,1.68 17.53,2.64 v17.53,3.4
N$12  (via drill 0.25)
  Top 0.178: U4.3 22.35,17.68 v22.86,18.19 | v26.98,14.83 26.36,14.22 C2.1 | 26.16,14.28 FB4.1
  Top 0.254: C2.1 26.16,14.28
  Bottom 0.178: v22.86,18.19 25.86,18.19 26.98,17.07 v26.98,14.83
N$15
  Top 0.178: FB3.1 22.3,10.72 22.35,10.77 U4.8 22.35,13.77 22.81,14.22 C2.2
N$16
  Top 0.178: R21.2 R16.1 4.34,45.36 SW1.2 SW1.4
N$17
  Top 0.178: U2.CBUS1 14.32,45.9 14.58,46.15 14.58,46.98 RX.C
N$18  (via drill 0.25)
  Top 0.178: TX.C 10.87,48.26 v10.11,47.5 | v18.44,41.45 18.44,42.19 18.11,42.52 U2.CBUS2
  Bottom 0.178: 18.34,41.45 v18.44,41.45 11.94,41.45 11.48,41.91 10.16,41.91 9.55,42.52 9.55,46.94 v10.11,47.5
N$25
  Top 0.178: U2.USBDM 18.35,43.52 20.07,41.81 20.78,41.81 21.44,41.15 23.36,41.15 R15.2
N$26  (via drill 0.25)
  Top 0.178: U2.USBDP 18.24,43.02 19.86,41.4 20.57,41.4 21.13,40.84 v21.13,40.59 | v21.69,41.71 23.32,41.71 24.11,42.5 R11.1
  Bottom 0.178: v21.69,41.71 21.13,41.15 v21.13,40.59
N$27
  Top 0.178: RX.A 17.94,47.52 R18.1
N$29
  Top 0.178: TX.A 13.91,47.52 R17.2
N$32
  Top 0.178: J4.D- 25.97,44.77 R15.1
N$33
  Top 0.178: J4.D+ 25.32,45.42 R11.2
PWR  (via drill 0.25)
  Top 0.508: U$4.P$4 U14.G+
  Top 0.813: D1.C C1.1 33.45,40.5 U8.3 36.11,40.48 37.2,41.57 U7.2 U7.1 | v8.94,49.02 7.62,47.7 v7.62,42.74 | v20.02,48.67 20.27,48.41 v20.27,45.52 | J2.2 2.95,33.02 5.23,30.73 v13.87,30.73
  Bottom 0.813: U7.1 37.2,45.81 36.27,46.74 31.39,46.74 28.55,43.89 21.13,43.89 20.27,44.76 v20.27,45.52 | v7.62,42.74 2.03,37.15 J2.2 | v20.02,48.67 9.28,48.67 8.94,49 v8.94,49.02 | v13.87,30.73 14.73,31.59 U14.G+
RESET  (via drill 0.25)
  Top 0.178: U5.29 25.15,38.21 v25.6,38.66 | v34.24,34.7 34.2,34.66 C12.1 R5.1 32.19,32.07 TC1.5
  Bottom 0.178: v25.6,38.66 30.38,38.66 34.24,34.8 v34.24,34.7
RX  (via drill 0.25)
  Top 0.178: v24.54,39.78 24.65,39.78 U5.30 | R19.1 11.02,44.53 10.46,43.97 v10.46,42.77
  Bottom 0.178: v24.54,39.78 24.28,40.03 19.48,40.03 19,40.51 19,43.99 18.47,44.53 12.22,44.53 v10.46,42.77
SCK  (via drill 0.25)
  Top 0.178: U5.17 27.7,32.04 28.45,31.29 29.84,31.29 v30.71,30.43 | TC1.3 33.46,29.6 v33.48,29.62 | U11.4 34.81,15.43 v34.8,15.44 | U12.6_SCK 40.31,24.26 39.98,23.93 v37.08,23.93
  Bottom 0.178: 36.47,23.32 33.48,26.31 v33.48,29.62 32.66,30.43 v30.71,30.43 | 36.47,23.32 36.47,17.12 v34.8,15.44 | v37.08,23.93 36.47,23.32
SCL  (via drill 0.25)
  Top 0.178: U5.28 25.65,37.64 26.36,38.35 | v31.19,34.49 R13.1 30.68,35.31 30.38,35.61 30.38,36.88 28.91,38.35 26.36,38.35 | v38.46,40.18 38.86,40.18 39.93,41.25 39.93,46.18 41.16,47.41 Q4.3 | J1.1 5.23,25.4 15.8,14.83 15.8,11.63 v16.36,11.07 16.36,3.71 v16.46,3.61 | U10.1 28.34,2.04 v28.35,2.03 | v25.86,39.78 26.36,39.27 26.36,38.35 | U4.10 24.11,12.37 v24.49,11.99 v26.52,11.99 | U18.4 42.41,3.25 v43.73,3.25 | Q4.3 42.57,47.91 R14.1 | U9.2 v49.73,32.25 v49.73,32.26 | v40.74,48.16 41.31,48.16 Q4.3
  Bottom 0.178: v31.19,34.49 31.19,33.88 30.94,33.63 29.97,33.63 29.31,34.29 29.31,36.73 28.5,37.54 24.74,37.54 23.47,38.81 17.78,38.81 17.02,39.57 7.37,39.57 4.83,37.03 4.83,27.08 3.15,25.4 J1.1 | v38.46,40.18 37.39,41.25 28.5,41.25 27.03,39.78 v25.86,39.78 | v28.35,2.03 25.09,2.03 23.82,0.76 17.64,0.76 16.46,1.94 v16.46,3.61 | v16.36,11.07 17.27,11.99 v24.49,11.99 | v43.73,3.25 40.03,3.25 38.25,5.03 27.53,5.03 26.42,6.15 26.42,11.89 v26.52,11.99 | v49.73,32.26 46.53,32.26 46.02,31.75 44.65,31.75 41.71,34.7 41.71,47.19 v40.74,48.16
SDA  (via drill 0.25)
  Top 0.178: U5.27 26.15,37.58 26.52,37.95 28.7,37.95 29.87,36.78 v29.87,34.54 30.58,33.83 31.47,33.83 32.31,34.67 R6.1 32.41,35.41 38.05,35.41 39.32,36.68 v39.32,37.19 | U10.6 24.6,1.44 23.93,0.76 21.39,0.76 17.02,5.13 v17.02,16.36 5.44,27.94 J1.2 | U4.9 22.85,13.25 23.22,13.61 24.38,13.61 v24.74,13.26 | U18.1 43.71,1.74 v43.73,1.73 | Q3.3 44.89,40.01 | 44.89,40.01 45.32,39.57 R34.1 | U9.4 48.36,33.22 48.67,33.53 v49.99,33.53 | v45.52,40.84 44.89,40.21 44.89,40.01 | v45.01,30.68 45.01,32.46 v44.65,32.82
  Bottom 0.178: v29.87,34.54 29.87,36.78 28.57,38.08 24.84,38.08 23.7,39.22 17.98,39.22 16.87,40.34 6.86,40.34 3.79,37.26 3.79,28.63 3.1,27.94 J1.2 | v17.02,16.36 17.02,17.07 19.25,19.3 21.23,19.3 22.05,18.49 22.05,15.39 24.18,13.26 v24.74,13.26 25.5,12.5 25.5,6.2 27.43,4.27 38.09,4.27 40.63,1.73 v43.73,1.73 | v49.99,33.53 46.69,33.53 45.97,32.82 v44.65,32.82 43.33,34.14 43.33,38.66 v45.52,40.84 | v39.32,37.19 39.32,35.92 44.55,30.68 v45.01,30.68
TX  (via drill 0.25)
  Top 0.178: v22.48,38.25 23.62,38.25 24.15,37.72 U5.31 | v16.66,38.63 R20.1
  Bottom 0.178: v16.66,38.63 17.04,38.25 v22.48,38.25
VBUS  (via drill 0.25)
  Top 0.254: U2.VCC v15.32,46.25
  Top 0.813: D1.A 29.47,44.2 30.23,44.96 v30.23,47.4 | TC1.2 34.73,26.94 v36.02,25.65
  Bottom 0.254: v15.32,46.25 15.32,46.97 15.75,47.4 v30.23,47.4
  Bottom 0.813: v30.23,47.4 31.24,48.41 36.88,48.41 39.67,45.62 39.67,40.03 38.41,38.76 38.41,36.22 34.72,32.54 34.72,26.95 v36.02,25.65
  pour Top (no thermals): 26.57,47.29 27.53,47.29 29.11,45.72 29.11,43.54 27.74,43.54 27.33,43.94 26.57,43.94
VCC  (via drill 0.25, 0.35)
  Top 0.178: 17.17,32.16 17.17,35.31 16.87,35.61 R10.1 | 17.17,32.16 17.17,27.08 18.14,26.11 18.69,26.11 | R16.2 4.39,44.35 3.91,43.87 v3.91,43.2 | 17.17,32.16 7.75,32.16 4.62,35.28 v4.62,41.27
  Top 0.254: FB3.2 C13.2 23.37,8.03 v19.86,4.52 | R22.1 v14.83,2.18 | U18.5 38.52,3.24 C21.2 38.51,3.61 39.42,4.52 v40.69,4.52 | U9.10 49.04,31.42 49.11,31.49 U9.1 | R3.2 R8.2 46.79,35.26 45.97,34.44 45.97,34.34 | v45.77,28.65 45.77,32.21 45.97,32.41 45.97,34.34 | R34.2 46.74,40.59 47.19,40.13 47.19,39.22 46.74,38.76 45.67,38.76 45.11,38.2 45.11,36.24 45.97,35.38 45.97,34.34
  Top 0.305: U5.18 28.86,33.55 C15.2 29.43,33.52 29.91,33.04 R5.2 | U5.4 22.25,35.05 21.74,34.54 22.24,34.05 U5.6 | 40.42,34.04 U6.3 40.39,34.04 | 49.04,31.42 49.33,31.14 49.33,30.58 48.92,30.18 C10.2 48.92,29.11 48.46,28.65 v45.77,28.65
  Top 0.406: U8.2 34.43,37.27 33.48,36.32 R6.2 R13.2 31.19,37.08 v30.93,37.33 | R5.2 32.15,33.32 v32.92,34.09 | 21.59,2.79 C7.2 | U10.5 21.69,2.69 21.59,2.79 | 24.48,21.91 C18.2 | v19.86,4.52 21.59,2.79 | U6.1 41.32,35.95 41.71,35.56 41.71,34.34 41.4,34.04 40.42,34.04
  Top 0.508: U8.2 34.45,38.25 C11.2 37.42,38.25 C4.1 | 18.69,26.11 C5.2 19.46,34.54 21.74,34.54 | C4.1 37.44,40.35 38.66,41.57 38.66,47.3 39.29,47.93 40.28,48.92 R14.2 | U1.VCC 24.48,21.91 | 18.69,26.11 18.69,5.69 v19.86,4.52 | 18.69,26.11 22.91,21.89 C18.2 25.76,21.89 27.94,24.08 33.98,24.08 34.81,23.25 U11.13 34.81,19.52 35.74,18.59 38.56,18.59 39.83,17.32 v39.83,16.56 39.83,15.04 37.29,12.5 v37.29,9.35 | v45.77,28.65 45.77,26.52 45.06,25.81 C9.2 42.88,25.81 U12.8_VCC U12.7_HOLD 41.58,27.81 40.31,29.08 U12.3_WP | 40.39,34.04 C17.2 37.69,34.04 v37.13,33.48 | C4.1 39.64,38.24 40.41,37.47 U6.1 | v27.79,9.35 26.88,9.35 R7.2
  Bottom 0.178: v3.91,43.2 3.91,41.83 4.47,41.27 v4.62,41.27
  Bottom 0.254: v19.86,4.52 16.36,4.52 14.83,3 v14.83,2.18 | v40.69,4.52 40.69,5.28 37.29,8.69 v37.29,9.35
  Bottom 0.406: v30.93,37.33 30.93,36.07 v32.92,34.09
  Bottom 0.508: v37.29,9.35 35.97,8.03 29.11,8.03 v27.79,9.35 | v45.77,28.65 45.16,28.65 41.4,32.41 38.2,32.41 v37.13,33.48 36.78,33.12 36.78,30.23 38.51,28.5 38.51,19.51 39.83,18.19 v39.83,16.56

### Text on the board
Bottom: AK
_tsilk: U3 | U9 | U9 | GND
_bsilk: PWR | GND | SDA | SCL | github.com/akstudios | v0.4 | July 2019 | Element Pro